# Altium schematic sheet Controller.SchDoc: Motor Controller - MCU
size A4; Author: Poteko Sakamoto; DrawnBy: Poteko Sakamoto; Revision: 1
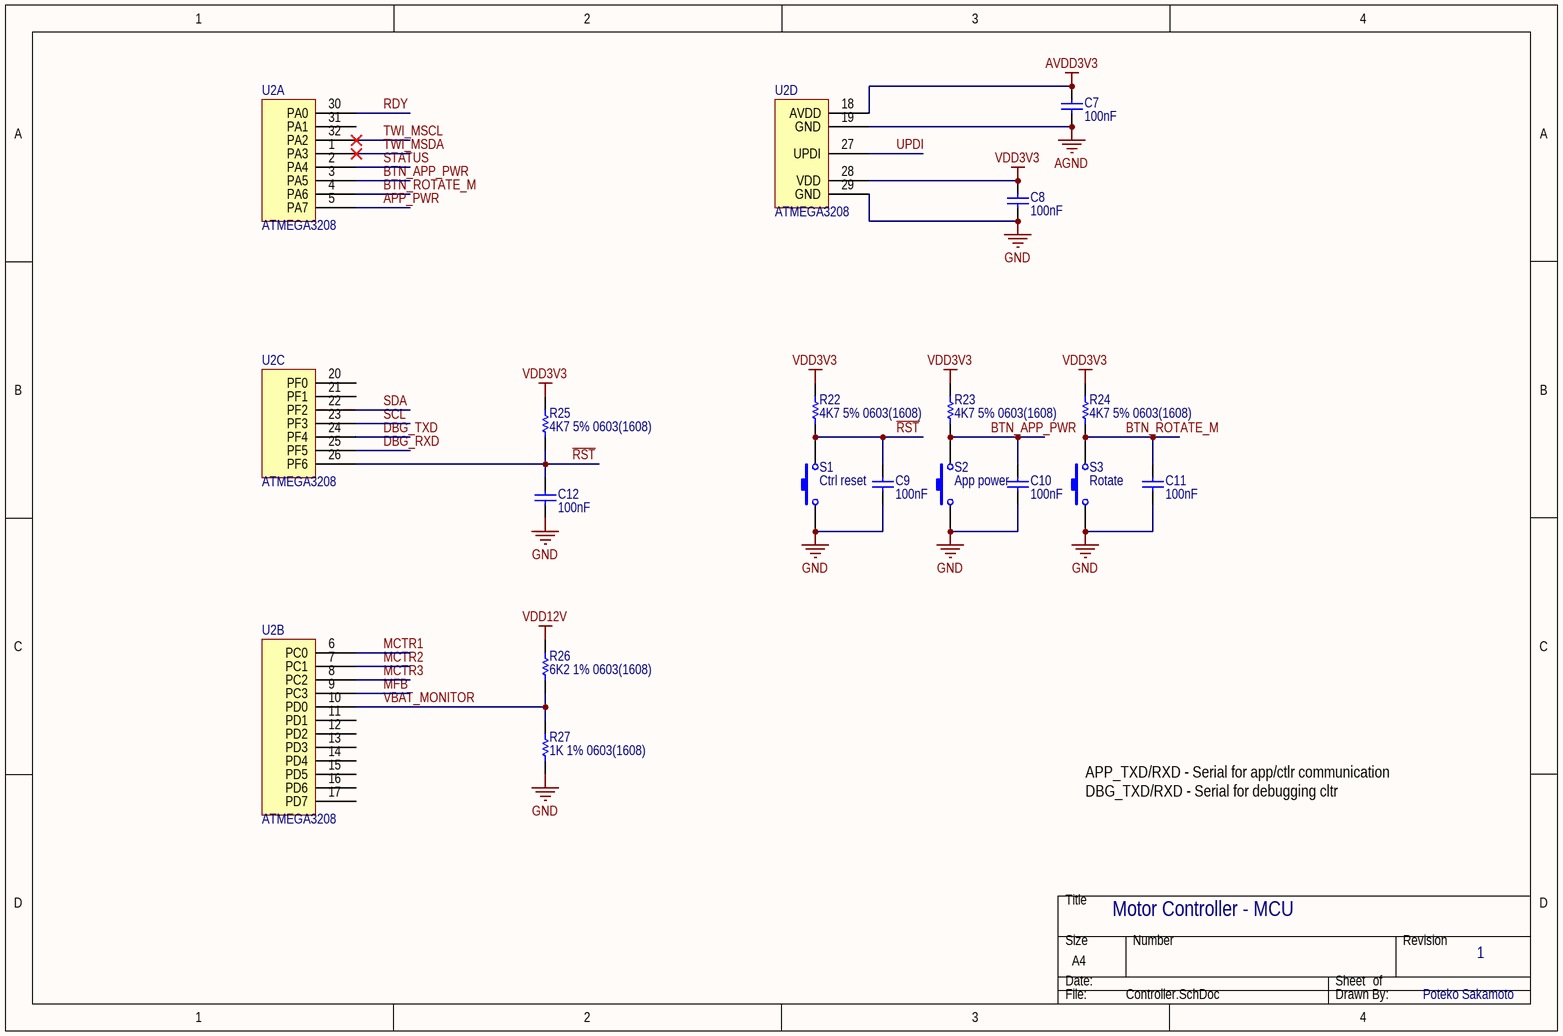
[diagram p0: Controller.SchDoc]

## Parts
C7  100nF  [CAPC0603(1608)100_M]
C8  100nF  [CAPC0603(1608)100_M]
C9  100nF  [CAPC0603(1608)100_M]
C10  100nF  [CAPC0603(1608)100_M]
C11  100nF  [CAPC0603(1608)100_M]
C12  100nF  [CAPC0603(1608)100_M]
R22  4K7 5% 0603(1608)  [RESC0603(1608)_M]
R23  4K7 5% 0603(1608)  [RESC0603(1608)_M]
R24  4K7 5% 0603(1608)  [RESC0603(1608)_M]
R25  4K7 5% 0603(1608)  [RESC0603(1608)_M]
R26  6K2 1% 0603(1608)  [RESC0603(1608)_M]
R27  1K 1% 0603(1608)  [RESC0603(1608)_M]
S1  Ctrl reset  [SMD Button]
S2  App power  [SMD Button]
S3  Rotate  [SMD Button]
U2  ATMEGA3208  [QFP80P900X900X120-32N]  (parts A,B,C,D of 4)

## Nets
AGND: C7.1 U2.19(GND)
AVDD3V3: C7.2 U2.18(AVDD)
GND: C8.1 C9.1 C10.1 C11.1 C12.1 R27.1 S1.1 S2.1 S3.1 U2.29(GND)
VDD3V3: C8.2 R22.2 R23.2 R24.2 R25.2 U2.28(VDD)
VDD12V: R26.2
APP_PWR: U2.5(PA7)
BTN_APP_PWR: C10.2 R23.1 S2.2 U2.3(PA5)
BTN_ROTATE_M: C11.2 R24.1 S3.2 U2.4(PA6)
DBG_RXD: U2.25(PF5)
DBG_TXD: U2.24(PF4)
MCTR1: U2.6(PC0)
MCTR2: U2.7(PC1)
MCTR3: U2.8(PC2)
MFB: U2.9(PC3)
~{RST}: C9.2 C12.2 R22.1 R25.1 S1.2 U2.26(PF6)
RDY: U2.30(PA0)
SCL: U2.23(PF3)
SDA: U2.22(PF2)
STATUS: U2.2(PA4)
TWI_MSCL: U2.32(PA2)
TWI_MSDA: U2.1(PA3)
UPDI: U2.27(UPDI)
VBAT_MONITOR: R26.1 R27.2 U2.10(PD0)

Not connected (* = marked no-connect by the designer): U2 11(PD1) 12(PD2) 13(PD3) 14(PD4) 15(PD5) 16(PD6) 17(PD7) 20(PF0) 21(PF1) 31(PA1)

## Notes on the sheet
- APP_TXD/RXD - Serial for app/ctlr communication
  DBG_TXD/RXD - Serial for debugging cltr

## Library data of the parts
C7-C12 = CMP-1035-02592-1: CAP 100nF 50V ±10% 0603 (1608 Metric) Thickness 1mm SMD; Case-EIA: 0603; Case-Metric: 1608; Tolerance: Â±10%; Technology: SMT; Rated Voltage: 50 V; Max Thickness: 1 mm; Value: 100nF
R22-R25 = CMP-1012-00090-1: 4K7 0.1W 5% 0603 (1608 Metric)  SMD; Case-Metric: 1608; Value: 4700.00 Ohm; Case-EIA: 0603; Tolerance: 5 %; Technology: SMT; Power: 0.1 W
R26 = CMP-1012-00599-1: 6K2 0.1W 1% 0603 (1608 Metric)  SMD; Case-Metric: 1608; Case-EIA: 0603; Value: 6200.00 Ohm; Tolerance: 1 %; Technology: SMT; Power: 0.1 W
R27 = CMP-1012-00510-1: 1K 0.1W 1% 0603 (1608 Metric)  SMD; Case-Metric: 1608; Case-EIA: 0603; Value: 1000.00 Ohm; Technology: SMT; Tolerance: 1 %; Power: 0.1 W
S1-S3 = SW-PB: Switch; Published: 24-Mar-1999; LatestRevisionDate: 17-Jul-2002; LatestRevisionNote: Re-released for DXP Platform.; PackageReference: SPST-2; Publisher: Altium Limited; PackageDescription: Switch; 2 Leads